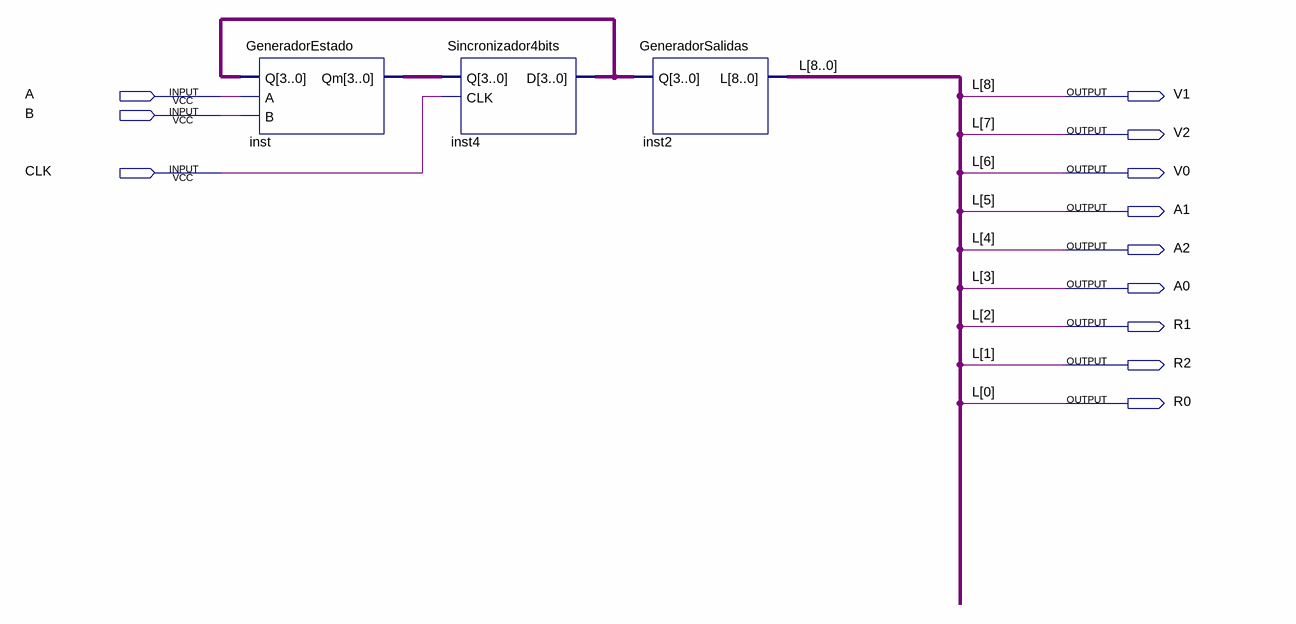
[diagram p0: schematic sheet]
// Quartus schematic MaquinaMoore2.bdf as structural Verilog: 3 symbols, 12 pins
module MaquinaMoore2 (
  input  A,
  input  B,
  input  CLK,
  output V1,
  output V2,
  output V0,
  output A1,
  output A2,
  output A0,
  output R1,
  output R2,
  output R0
);

  wire [3:0] inst4_d, inst_qm;

  GeneradorEstado inst (.Q(inst4_d), .A(A), .B(B), .Qm(inst_qm));
  Sincronizador4bits inst4 (.Q(inst_qm), .CLK(CLK), .D(inst4_d));
  GeneradorSalidas inst2 (.Q(inst4_d), .L({V1, V2, V0, A1, A2, A0, R1, R2, R0}));

  // Other names for the same wires on the sheet: L[8:0] = {V1, V2, V0, A1, A2, A0, R1, R2, R0}
endmodule
